# EAGLE design lund (EAGLE 5.10)
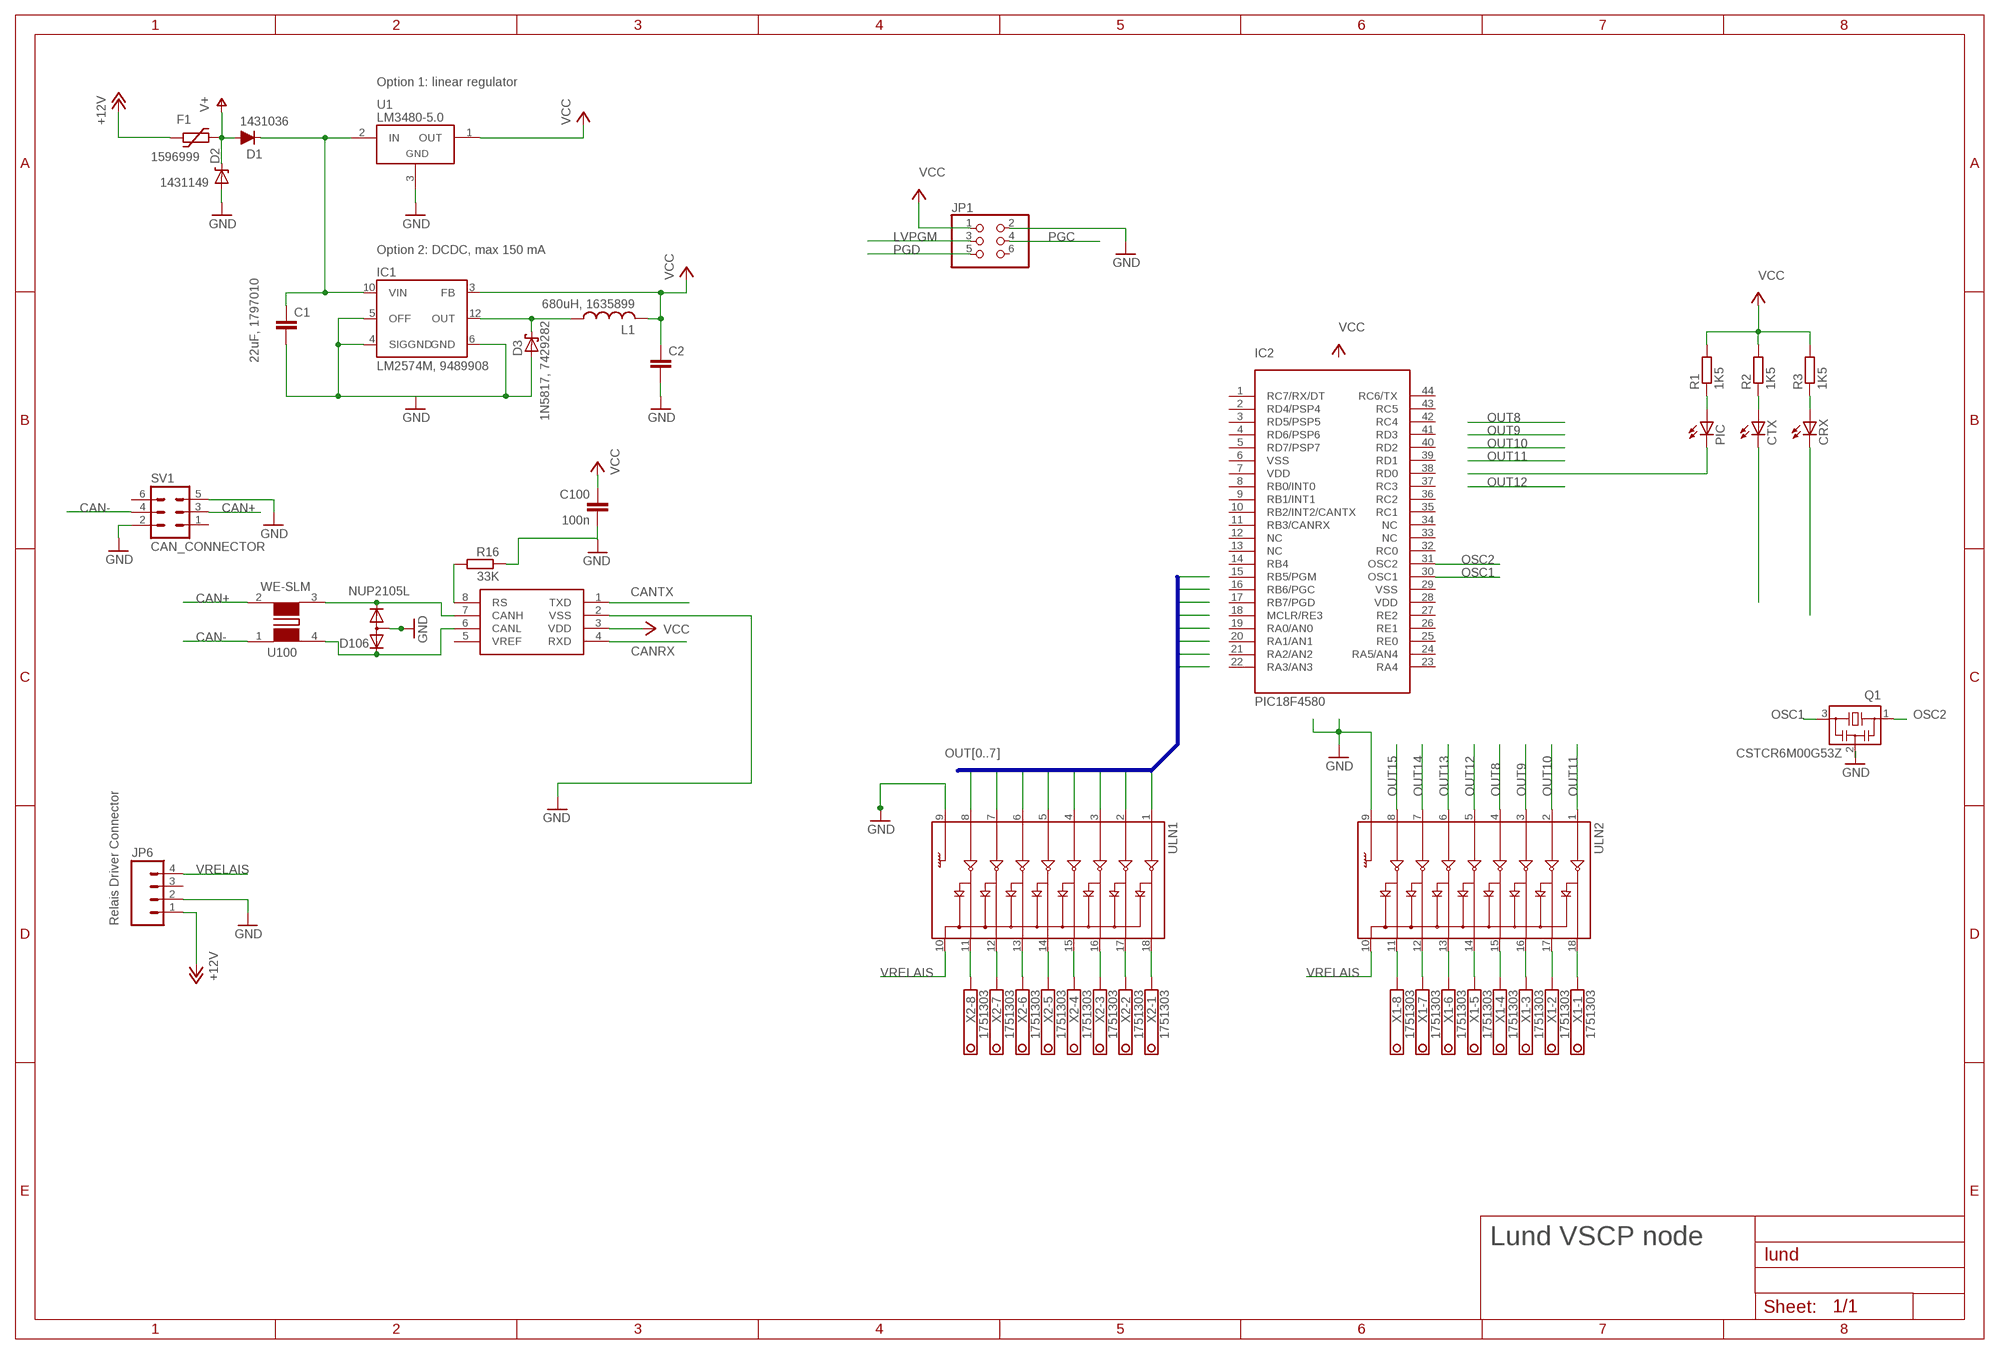
[diagram p0: schematic, sheet 1]

## Parts
C1  22uF, 1797010  C-EUC1206K  [C1206K]
C2  C-EUC1210K  [C1210K]
C100  100n  C-EUC0805  [C0805]
CRX  LEDCHIPLED_0805  [CHIPLED_0805]
CTX  LEDCHIPLED_0805  [CHIPLED_0805]
D1  1431036  D-FILL-SOD123  [SOD123]
D2  1431149  DIODE-ZENER403D-02  [403D-02]
D3  1N5817, 7429282  1N5817-B  [DO41-7.6]
D106  NUP2105L  DIODE-2CA|ACSOT23  [SOT23]
F1  1596999  1812L  [1812L]
IC1  LM2574M, 9489908  LM2574M  [SO14W]
IC2  PIC18F4580  [TQFP44]
JP1  PINHD-2X3  [2X03]
JP6  M04SIDE_EDGE_5.08  [CAMDEN_BOSS_1X4_OPEN]
L1  680uH, 1635899  L-USWE-TPC  [POWER-CHOKE_WE-TPC]
PIC  LEDCHIPLED_0805  [CHIPLED_0805]
Q1  CSTCR6M00G53Z  [CSTCR6M]
R1  1K5  R-EU_R0805  [R0805]
R2  1K5  R-EU_R0805  [R0805]
R3  1K5  R-EU_R0805  [R0805]
R16  33K  R-EU_R0805  [R0805]
SV1  CAN_CONNECTOR  ML6L  [ML6L]
U1  LM3480-5.0  [SOT-23-3]
U2  MCP2551  [SO08]
U100  WE-SLM  [WE-SLM]
ULN1  ULN2803SOIC  [SO018]
ULN2  ULN2803SOIC  [SO018]
X1  1751303  [1751303]
X2  1751303  [1751303]

## Nets
+12V: F1.P$1 JP6.1
CAN+: SV1.3 U100.2
CAN-: SV1.4 U100.1
CANRX: CRX.C U2.4(RXD)
CANTX: CTX.C U2.1(TXD)
GND: C2.2 C100.2 D2.P$2(A) D106.3(A) JP1.2 JP6.2 Q1.2 R16.1 SV1.2 SV1.5 U1.3(GND) U2.2(VSS) ULN1.9 ULN2.9
LVPGM: JP1.3
N$1: ULN2.11 X1.8
N$2: D106.2(K2) U2.7(CANH) U100.3
N$3: ULN2.12 X1.7
N$4: C1.1 D1.1(C) IC1.10(VIN) U1.2(IN)
N$7: R16.2 U2.8(RS)
N$9: C1.2 D3.A IC1.4(SIGGND) IC1.5(OFF) IC1.6(GND)
N$10: PIC.C
N$11: PIC.A R1.1
N$12: CTX.A R2.1
N$13: ULN2.13 X1.6
N$14: CRX.A R3.1
N$15: ULN2.14 X1.5
N$16: D3.C IC1.12(OUT) L1.1
N$17: ULN2.15 X1.4
N$18: ULN2.16 X1.3
N$19: ULN2.17 X1.2
N$20: ULN2.18 X1.1
N$21: ULN1.18 X2.1
N$22: ULN1.17 X2.2
N$23: ULN1.16 X2.3
N$24: ULN1.15 X2.4
N$25: D106.1(K1) U2.6(CANL) U100.4
N$26: ULN1.14 X2.5
N$27: ULN1.13 X2.6
N$28: ULN1.12 X2.7
N$29: ULN1.11 X2.8
OSC1: IC2.30(OSC1) Q1.3
OSC2: IC2.31(OSC2) Q1.1
OUT0: ULN1.8
OUT1: ULN1.7
OUT2: ULN1.6
OUT3: ULN1.5
OUT4: ULN1.1
OUT5: ULN1.2
OUT6: ULN1.3
OUT7: ULN1.4
OUT8: ULN2.4
OUT9: ULN2.3
OUT10: ULN2.2
OUT11: ULN2.1
OUT12: ULN2.5
OUT13: ULN2.6
OUT14: ULN2.7
OUT15: ULN2.8
PGC: JP1.4
PGD: JP1.5
V+: D1.2(A) D2.P$1(C) F1.P$2
VCC: C2.1 C100.1 IC1.3(FB) JP1.1 L1.2 R1.2 R2.2 R3.2 U1.1(OUT) U2.3(VDD)
VRELAIS: JP6.4 ULN1.10 ULN2.10
Unconnected: IC2.1(RC7/RX/DT) IC2.2(RD4/PSP4) IC2.3(RD5/PSP5) IC2.4(RD6/PSP6) IC2.5(RD7/PSP7) IC2.8(RB0/INT0) IC2.9(RB1/INT1) IC2.10(RB2/INT2/CANTX) IC2.11(RB3/CANRX) IC2.12(NC) IC2.13(NC) IC2.14(RB4) IC2.15(RB5/PGM) IC2.16(RB6/PGC) IC2.17(RB7/PGD) IC2.18(MCLR/RE3) IC2.19(RA0/AN0) IC2.20(RA1/AN1) IC2.21(RA2/AN2) IC2.22(RA3/AN3) IC2.23(RA4) IC2.24(RA5/AN4) IC2.25(RE0) IC2.26(RE1) IC2.27(RE2) IC2.32(RC0) IC2.33(NC) IC2.34(NC) IC2.35(RC1) IC2.36(RC2) IC2.37(RC3) IC2.38(RD0) IC2.39(RD1) IC2.40(RD2) IC2.41(RD3) IC2.42(RC4) IC2.43(RC5) IC2.44(RC6/TX) JP1.6 JP6.3 SV1.1 SV1.6 U2.5(VREF)

## Buses
OUT[0..7]

## Notes on the sheet
- Option 1: linear regulator
- Option 2: DCDC, max 150 mA
- Relais Driver Connector
- Lund VSCP node

## Power pins joined to a net without a drawn wire
VDD: IC2.7(VDD) IC2.28(VDD)
VSS: IC2.6(VSS) IC2.29(VSS)

## Library data of the parts
C1 C2 C100 = rcl:C-EU: CAPACITOR, European symbol
CRX CTX PIC = led:LED: LED OSRAM: - CHIPLED LG R971, LG N971, LY N971, LG Q971, LY Q971, LO R971, LY R971 LH N974, LH R974 LS Q976, LO Q976, LY Q976 LO Q996 - Hyper CHIPLED LW Q18S LB Q993, LB Q99A, LB R99A - SideLED LS A670, LO A670, LY A670, LG A670, LP A670 LB A673, LV A673, LT A673, LW A673 LH A674 LY A675 LS A676, LA A676, LO A676, LY A676, LW A676 LS A679, LY A679, LG A679 - Hyper Micro SIDELED® LS Y876, LA Y876, LO Y876, LY Y876 LT Y87S - SmartLED LW L88C, LW L88S LB L89C, LB L89S, LG L890 LS L89K, LO L89K, LY L89K LS L896, LA L896, LO L896, LY L896 - TOPLED LS T670, LO T670, LY T670, LG T670, LP T670 LSG T670, LSP T670, LSY T670, LOP T670, LYG T670 LG T671, LOG T671, LSG T671 LB T673, LV T673, LT T673, LW T673 LH T674 LS T676, LA T676, LO T676, LY T676, LB T676, LH T676, LSB T676, LW T676 LB T67C, LV T67C, LT T67C, LS T67K, LO T67K, LY T67K, LW E67C LS E67B, LA E67B, LO E67B, LY E67B, LB E67C, LV E67C, LT E67C LW T67C LS T679, LY T679, LG T679 LS T770, LO T770, LY T770, LG T770, LP T770 LB T773, LV T773, LT T773, LW T773 LH T774 LS E675, LA E675, LY E675, LS T675 LS T776, LA T776, LO T776, LY T776, LB T776 LHGB T686 LT T68C, LB T68C - Hyper Mini TOPLED® LB M676 - Mini TOPLED Santana® LG M470 LS M47K, LO M47K, LY M47K Source: http://www.osram.convergy.de LUXEON: - LUMILED® LXK2-PW12-R00, LXK2-PW12-S00, LXK2-PW14-U00, LXK2-PW14-V00 LXK2-PM12-R00, LXK2-PM12-S00, LXK2-PM14-U00 LXK2-PE12-Q00, LXK2-PE12-R00, LXK2-PE12-S00, LXK2-PE14-T00, LXK2-PE14-U00 LXK2-PB12-K00, LXK2-PB12-L00, LXK2-PB12-M00, LXK2-PB14-N00, LXK2-PB14-P00, LXK2-PB14-Q00 LXK2-PR12-L00, LXK2-PR12-M00, LXK2-PR14-Q00, LXK2-PR14-R00 LXK2-PD12-Q00, LXK2-PD12-R00, LXK2-PD12-S00 LXK2-PH12-R00, LXK2-PH12-S00 LXK2-PL12-P00, LXK2-PL12-Q00, LXK2-PL12-R00 Source: www.luxeon.com KINGBRIGHT: KA-3528ASYC Source: www.kingbright.com
D1 = semicon-smd-ipc:D-FILL-: DIODE filled
D2 = SparkFun:DIODE-ZENER: Zener Diode Production Part - 8199 3.4V Zener Voltage
D3 = diode:1N581*: 1.0A SCHOTTKY BARRIER RECTIFIER Source: http://www.diodes.com/datasheets/ds23001.pdf
D106 = diode:DIODE-2CA|AC: Dual DIODE Cathode-Anode|Anode-Cathode
F1 = ptc-littlefuse:1812L
IC1 = v-reg-3:LM2574: National Semiconductor <http://www.national.com> 0.5A "Simple Switcher"(c) 52kHz, Vout 1.23-37V (HV: 57V), Vin 40V (HV: 60V), 50µA standby current
IC2 = microchip:PIC18F4580
JP1 = pinhead:PINHD-2X3: PIN HEADER
JP6 = SparkFun:M04: Header 4 Standard 4-pin 0.1" header. Use with straight break away headers (SKU : PRT-00116), right angle break away headers (PRT-00553), swiss pins (PRT-00743), machine pins (PRT-00117), and female headers (PRT-00115). Molex polarized connector foot print use with SKU : PRT-08231 with associated crimp pins and housings.
L1 = rcl:L-US: INDUCTOR, American symbol
Q1 = murata-filter:CSTCR: Resonator Source: murata.co.jp
R1-R3 R16 = rcl:R-EU_: RESISTOR, European symbol
SV1 = con-harting-ml:ML6: HARTING
U1 = regulators:LM3480-*: National Semiconductor LM3480 100 mA, SOT-23, quasi-LDO linear regulator
U2 = SparkFun:MCP2551
U100 = wuerth-elektronik:WE-SLM
ULN1 ULN2 = SparkFun:ULN2803: Darlington Driver ULN2803 Darlington array. 500mA max per channel, 8-channel package. Spark Fun Electronics SKU : COM-00312
X1 X2 = con-phoenix-350:1751303: MKDS 1/ 8-3,5 Printklemme Nennstrom: 10 A Bemessungsspannung: 160 V Raster: 3,5 mm Polzahl: 8 Montageart: Löten Anschlussart: Schraubanschluss Anschlussrichtung vom Leiter zur Platine: 0° Source: http://eshop.phoenixcontact.com .. .pdf

## Board
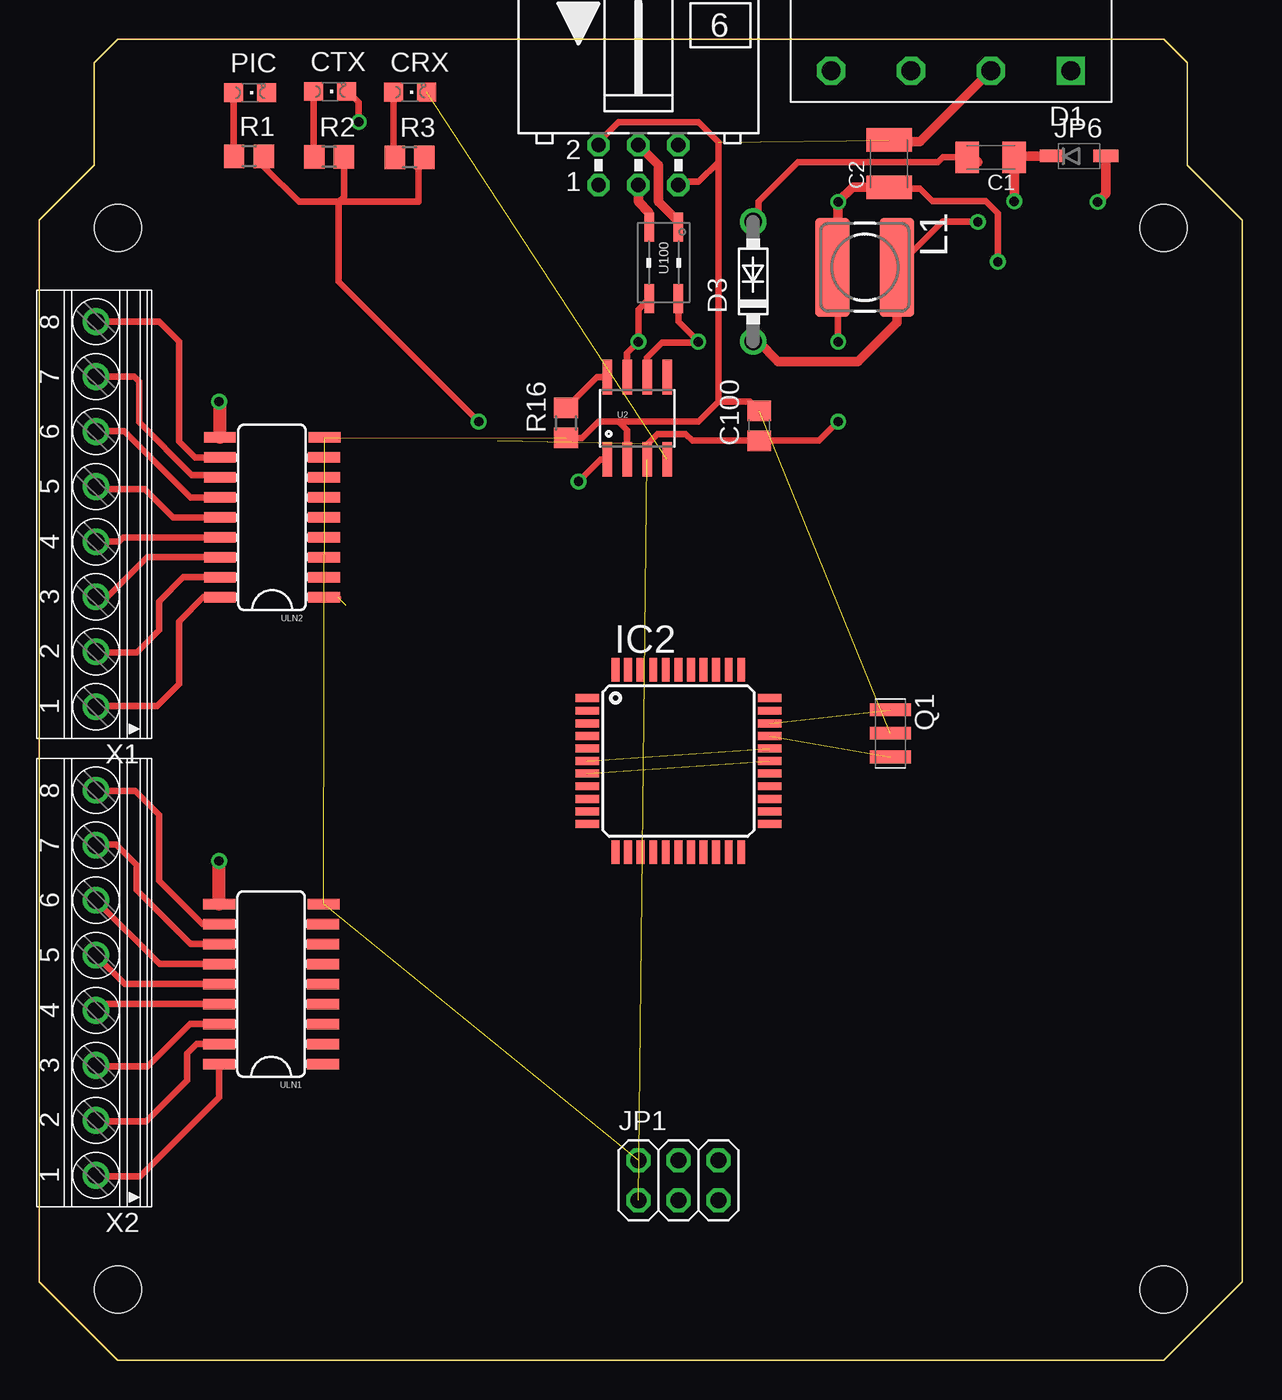
[diagram p1: board, top side]
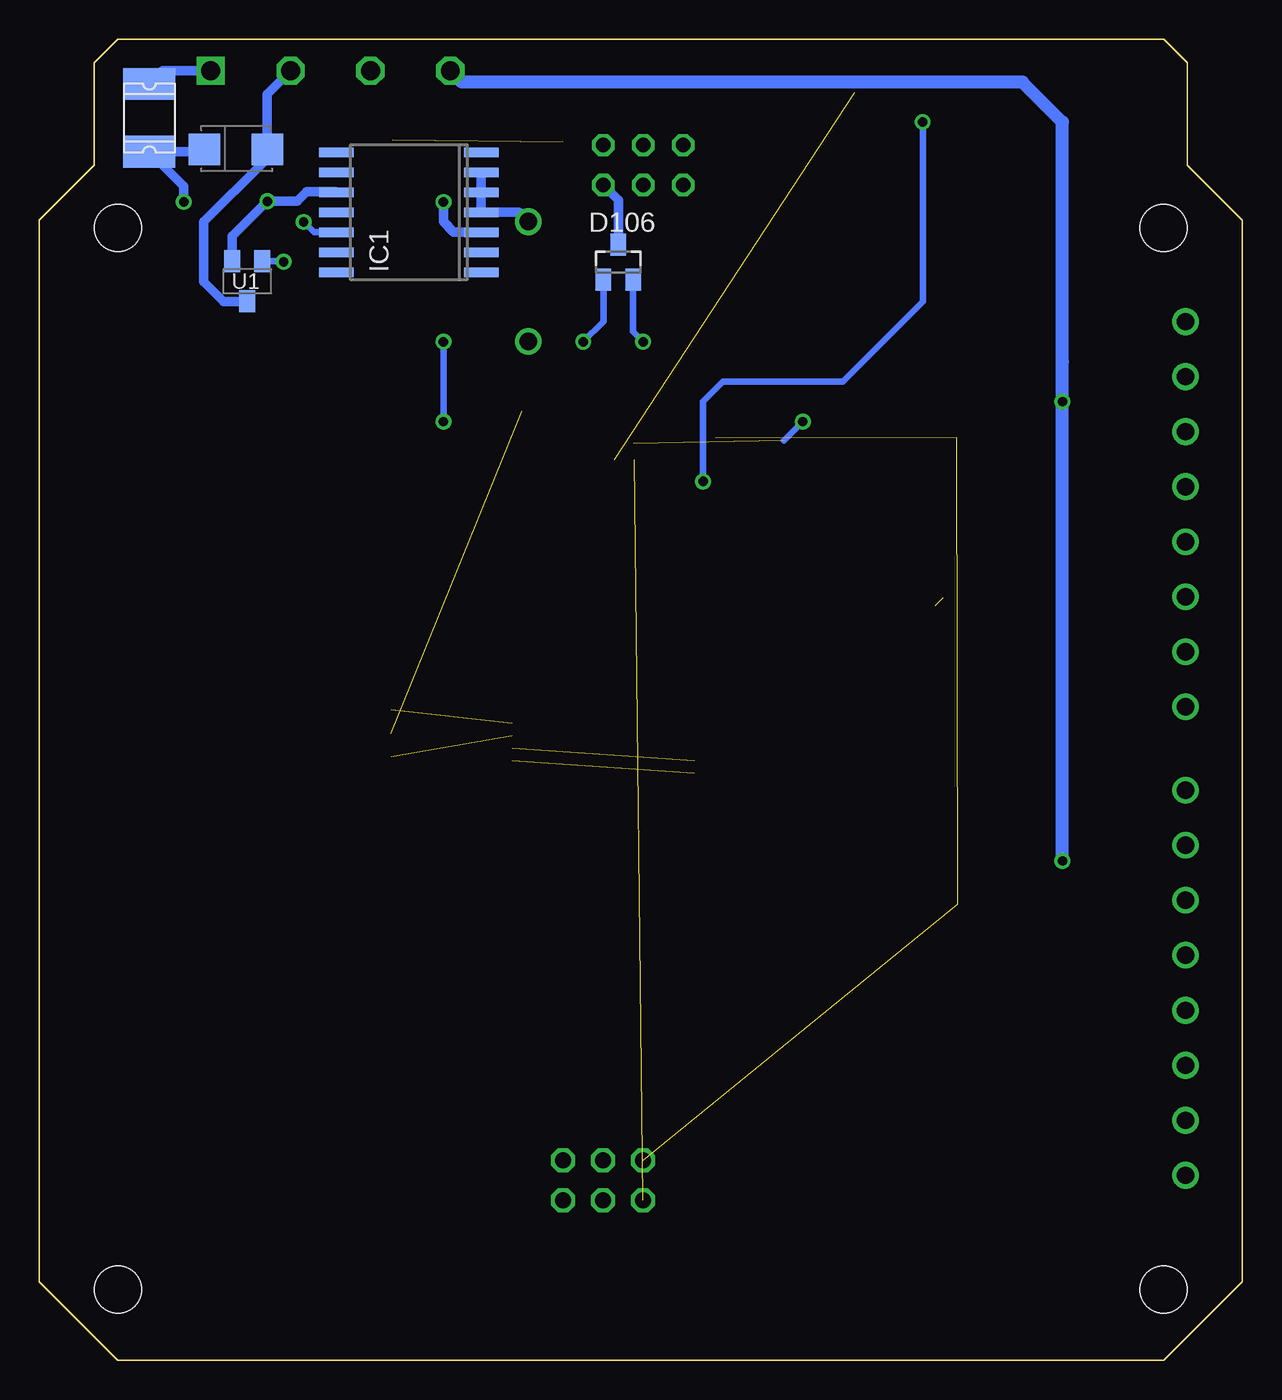
[diagram p2: board, bottom side, seen from below]

Size 76.5 x 84 mm. Coordinates in mm from the lower left corner, seen from the top.
Outline: 5,0 0,5 0,72.5 3.5,76 3.5,82.5 5,84 71.5,84 73,82.5 73,76 76.5,72.5 76.5,5 71.5,0 5,0
Copper layers (1*16): Top 0.035mm / dielectric 1.5mm / Bottom 0.035mm
Design rules "default": minimum track width 10mil, minimum drill 24mil, track to track 8mil, track to pad 8mil, pad to pad 8mil, via to via 8mil, smd to smd 8mil, copper to edge 40mil, drill to drill 8mil, minimum pad ring 10mil, minimum via ring 8mil, stop-mask expansion 4mil, vias tented up to drill 0mil, thermal gap 10mil
Holes 3 mm at 5,4.5 71.5,4.5 71.5,72 5,72

### Footprints (pad centres in the part's own frame; a part is rotated, then mirrored left to right if it is on the bottom)
C1206K = smd 1.5 x 2: 1 -1.5,0; 2 1.5,0
C1210K = smd 1.5 x 2.9: 1 -1.5,0; 2 1.5,0
C0805 = smd 1.3 x 1.5: 1 -0.95,0; 2 0.95,0
CHIPLED_0805 = smd 1.2 x 1.2: A 0,-1.05; C 0,1.05
SOD123 = smd 1.6 x 0.8: 1 -1.7,0; 2 1.7,0
403D-02 = smd 2 x 2: P$1 0,0; P$2 4,0
DO41-7.6 = drill 1.1 pad 1.7 round: A 3.81,0; C -3.81,0
SOT23 = smd 1 x 1.4: 1 -0.95,-1.1; 2 0.95,-1.1; 3 0,1.1
1812L = smd 2.03 x 3.3: P$1 -2.16,0; P$2 2.16,0
SO14W = smd 0.6 x 2.2: 1 -3.81,-4.6; 2 -2.54,-4.6; 3 -1.27,-4.6; 4 0,-4.6; 5 1.27,-4.6; 6 2.54,-4.6; 7 3.81,-4.6; 8 3.81,4.6; 9 2.54,4.6; 10 1.27,4.6; 11 0,4.6; 12 -1.27,4.6; 13 -2.54,4.6; 14 -3.81,4.6
TQFP44 = smd 1.5 x 0.5: 1 -5.8,4; 2 -5.8,3.2; 3 -5.8,2.4; 4 -5.8,1.6; 5 -5.8,0.8; 6 -5.8,0; 7 -5.8,-0.8; 8 -5.8,-1.6; 9 -5.8,-2.4; 10 -5.8,-3.2; 11 -5.8,-4; 23 5.8,-4; 24 5.8,-3.2; 25 5.8,-2.4; 26 5.8,-1.6; 27 5.8,-0.8; 28 5.8,0; 29 5.8,0.8; 30 5.8,1.6; 31 5.8,2.4; 32 5.8,3.2; 33 5.8,4 | smd 0.5 x 1.5: 12 -4,-5.8; 13 -3.2,-5.8; 14 -2.4,-5.8; 15 -1.6,-5.8; 16 -0.8,-5.8; 17 0,-5.8; 18 0.8,-5.8; 19 1.6,-5.8; 20 2.4,-5.8; 21 3.2,-5.8; 22 4,-5.8; 34 4,5.8; 35 3.2,5.8; 36 2.4,5.8; 37 1.6,5.8; 38 0.8,5.8; 39 0,5.8; 40 -0.8,5.8; 41 -1.6,5.8; 42 -2.4,5.8; 43 -3.2,5.8; 44 -4,5.8
2X03 = drill 1.016 octagon: 1 -2.54,-1.27; 2 -2.54,1.27; 3 0,-1.27; 4 0,1.27; 5 2.54,-1.27; 6 2.54,1.27
CAMDEN_BOSS_1X4_OPEN = drill 1.2 square: 1 0,0 | drill 1.2 octagon: 2 5.08,0; 3 10.16,0; 4 15.24,0
POWER-CHOKE_WE-TPC = smd 6.3 x 2.2: 1 0,2.05; 2 0,-2.05
CSTCR6M = smd 0.8 x 2.6: 1 -1.5,0; 2 0,0; 3 1.5,0
R0805 = smd 1.3 x 1.5: 1 -0.95,0; 2 0.95,0
ML6L = drill 0.914 octagon: 1 -2.54,-1.27; 2 -2.54,1.27; 3 0,-1.27; 4 0,1.27; 5 2.54,-1.27; 6 2.54,1.27
SOT-23-3 = smd 1.016 x 1.397: 1 -0.953,-1.27; 2 0.953,-1.27; 3 0,1.27
SO08 = smd 0.61 x 2.21: 1 -1.905,-2.616; 2 -0.635,-2.616; 3 0.635,-2.616; 4 1.905,-2.616; 5 1.905,2.616; 6 0.635,2.616; 7 -0.635,2.616; 8 -1.905,2.616
WE-SLM = smd 0.6 x 1.85: 1 0.932,2.268; 2 -0.932,2.268; 3 -0.932,-2.294; 4 0.932,-2.294
SO018 = smd 0.66 x 2.032: 1 -5.08,-3.315; 2 -3.81,-3.315; 3 -2.54,-3.315; 4 -1.27,-3.315; 5 0,-3.315; 6 1.27,-3.315; 7 2.54,-3.315; 8 3.81,-3.315; 9 5.08,-3.353; 10 5.08,3.315; 11 3.81,3.315; 12 2.54,3.315; 13 1.27,3.315; 14 0,3.315; 15 -1.27,3.315; 16 -2.54,3.315; 17 -3.81,3.315; 18 -5.08,3.315
1751303 = drill 1.1 pad 1.7 round: 1 -12.25,-0.1; 2 -8.75,-0.1; 3 -5.25,-0.1; 4 -1.75,-0.1; 5 1.75,-0.1; 6 5.25,-0.1; 7 8.75,-0.1; 8 12.25,-0.1

### Placement (x,y rotation side)
C1  60.5,76.5 180 top
C2  54.04,76.09 90 top
C100  45.79,59.42 90 top
CRX  23.58,80.64 270 top
CTX  18.5,80.68 270 top
D1  66.12,76.57 0 top
D2  66,77 0 bottom
D3  45.4,68.6 90 top
D106  39.68,69.83 0 bottom
F1  69.5,79 270 bottom
IC1  53,73 90 bottom
IC2  40.64,38.1 0 top
JP1  40.64,11.43 0 top
JP6  65.6,82 180 top
L1  52.5,69.5 270 top
PIC  13.4,80.6 270 top
Q1  54.13,39.86 270 top
R1  13.34,76.56 0 top
R2  18.43,76.52 0 top
R3  23.55,76.5 0 top
R16  33.5,59.6 90 top
SV1  38.1,76 0 top
U1  63.28,68.61 180 bottom
U2  38.02,59.9 0 top
U100  39.71,69.79 0 top
ULN1  14.74,23.92 90 top
ULN2  14.8,53.6 90 top
X1  3.5,53.8 90 top
X2  3.5,24 90 top

### Tracks (layer width: path | path; a pad name or v marks a point on that pad's centre or on a via)
+12V
  Bottom 0.61: JP6.1 68.66,82 F1.P$1
CAN+
  Top 0.61: U100.2 38.78,72.98 38.1,73.66 SV1.3
CAN-
  Top 0.61: U100.1 40.64,72.39 39.37,73.66 39.37,76 SV1.4
CANRX  (1 unrouted)
CANTX  (via drill 0.6)
  Top 0.406: U2.1 35.69,57.28 v34.29,55.88 | CTX.C 19.65,80.68 20.32,80.01 v20.32,78.74
  Bottom 0.406: v20.32,78.74 20.32,67.31 25.4,62.23 33.02,62.23 34.29,60.96 v34.29,55.88
GND  (5 unrouted)
  Top 0.406: SV1.2 35.56,77.47 36.83,78.74 41.91,78.74 43.18,77.47 43.18,76.2 | 43.18,76.2 41.91,74.93 40.84,74.93 SV1.5 | R16.1 34.52,58.65 35.56,59.69 36.83,59.69 | U2.2 37.38,59.13 36.83,59.69 | 36.83,59.69 41.91,59.69 43.18,60.96 | 43.18,60.96 45.2,60.96 C100.2 | 43.18,60.96 43.18,76.2
  Top 0.61: JP6.2 56,77.48 54.15,77.48
  Top 0.813: 54.15,77.48 C2.2
  Bottom 0.61: JP6.2 62,80.52 D2.P$2 62.23,76.77 62.23,76.2 66.04,72.39 66.04,68.58 64.77,67.31 63.31,67.31 U1.3 | D106.3 39.68,73.77 SV1.5
N$1
  Top 0.406: ULN2.11 9.9,57.41 8.89,58.42 8.89,64.77 7.62,66.04 X1.8
N$2  (via drill 0.6)
  Top 0.406: U100.3 38.1,66.82 v38.1,64.77 37.38,64.06 U2.7
  Bottom 0.406: D106.2 38.73,65.4 v38.1,64.77
N$3
  Top 0.406: X1.7 6.03,62.55 6.35,62.23 6.35,59.65 9.7,56.3 11.32,56.3 ULN2.12
N$4  (via drill 0.6)
  Top 0.61: D1.1 62.07,76.57 C1.1 v62,73.7
  Bottom 0.61: IC1.10 57.63,74.3 59.5,74.3 60.1,73.7 v62,73.7 64.23,71.47 U1.2
N$7
  Top 0.406: U2.8 35.47,62.52 R16.2
N$9
  Top 0.406: C1.2 57.45,76.5 57.15,76.2 48.26,76.2 45.72,73.66 45.72,72.73 D3.A
  Top 0.61: C1.2 59.39,76.5 59.69,76.2
  Bottom 0.61: D3.A 45.99,73 IC1.4 IC1.5 IC1.6
N$11
  Top 0.406: PIC.A 12.35,76.6 R1.1
N$12
  Top 0.406: CTX.A 17.45,76.55 R2.1
N$13
  Top 0.406: ULN2.13 9.63,54.87 5.4,59.1 3.65,59.1 X1.6
N$14
  Top 0.406: CRX.A 22.53,76.57 R3.1
N$15
  Top 0.406: ULN2.14 8.5,53.6 6.7,55.4 3.75,55.4 X1.5
N$16  (via drill 0.6)
  Top 0.406: v59.69,72.39 57.44,72.39 L1.1
  Top 0.61: L1.1 54.55,65.98 52.07,63.5 46.99,63.5 45.72,64.77 45.42,64.77 D3.C
  Bottom 0.406: IC1.12 59.03,71.73 v59.69,72.39
N$17
  Top 0.406: ULN2.15 5.34,52.33 5.08,52.07 3.62,52.07 X1.4
N$18
  Top 0.406: ULN2.16 6.86,51.06 4.3,48.5 3.65,48.5 X1.3
N$19
  Top 0.406: ULN2.17 9.15,49.79 7.62,48.26 7.62,46.42 6.2,45 3.65,45 X1.2
N$20
  Top 0.406: ULN2.18 10.42,48.52 8.89,46.99 8.89,42.99 7.5,41.6 3.65,41.6 X1.1
N$21
  Top 0.406: ULN1.18 11.43,16.73 6.4,11.7 3.65,11.7 X2.1
N$22
  Top 0.406: ULN1.17 10.01,20.11 9.4,19.5 9.4,17.8 6.8,15.2 3.65,15.2 X2.2
N$23
  Top 0.406: ULN1.16 9.58,21.38 6.9,18.7 3.65,18.7 X2.3
N$24
  Top 0.406: ULN1.15 4,22.65 X2.4
N$25  (via drill 0.6)
  Top 0.406: U100.4 40.64,66.04 v41.91,64.77 41.84,64.7 39.6,64.7 38.66,63.76 U2.6
  Bottom 0.406: D106.1 40.63,66.05 v41.91,64.77
N$26
  Top 0.406: ULN1.14 5.43,23.92 X2.5
N$27
  Top 0.406: ULN1.13 7.66,25.19 X2.6
N$28
  Top 0.406: ULN1.12 9.64,26.46 6.2,29.9 6.2,31.5 4.9,32.8 3.65,32.8 X2.7
N$29
  Top 0.406: ULN1.11 10.37,27.73 7.62,30.48 7.62,34.68 6.1,36.2 3.65,36.2 X2.8
OSC1  (1 unrouted)
OSC2  (1 unrouted)
OUT11  (1 unrouted)
  Top 0.406: 19,48.5 18.14,48.5 ULN2.1
V+  (via drill 0.6)
  Top 0.61: D1.2 67.82,74.17 v67.31,73.66
  Bottom 0.61: D2.P$1 66.16,76.84 F1.P$2 67.31,74.65 v67.31,73.66
VCC  (via drill 0.6)  (2 unrouted)
  Top 0.406: R1.2 14.29,75.88 16.51,73.66 19.05,73.66 | 19.05,73.66 24.13,73.66 24.13,76.13 R3.2 | R2.2 19.38,73.99 19.05,73.66 | v27.94,59.69 19.05,68.58 19.05,73.66 | U2.3 38.7,57.33 38.7,58.3 39.3,58.9 41.1,58.9 41.53,58.47 C100.1 49.58,58.47 v50.8,59.69 | v60.96,69.85 60.96,72.94 60.2,73.7 56.8,73.7 56,74.5 54.13,74.5 C2.1 | v50.8,64.77 50.8,69.85
  Top 0.61: L1.2 50.8,69.85 v50.8,73.66 51.73,74.59 C2.1
  Bottom 0.406: v27.94,59.69 29.14,58.49 | U1.1 60.99,69.88 v60.96,69.85 | v50.8,59.69 v50.8,64.77
  Bottom 0.61: IC1.3 50.14,71.73 50.8,72.39 v50.8,73.66
VDD  (1 unrouted)
VRELAIS  (via drill 0.6)
  Top 0.813: ULN1.10 v11.43,31.75 | ULN2.10 11.48,60.91 v11.43,60.96
  Bottom 0.813: v11.43,31.75 v11.43,60.96 11.43,63.5 11.43,78.74 13.97,81.28 49.64,81.28 JP6.4
VSS  (1 unrouted)